# Altium schematic sheet RF_SCH.SchDoc
size A4
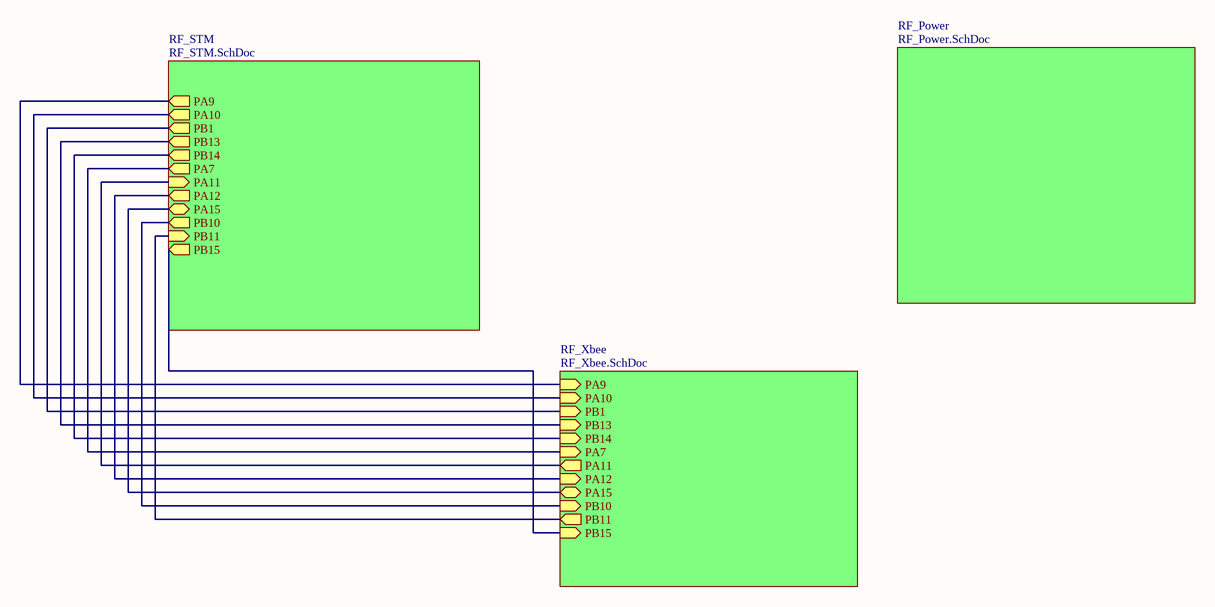
[diagram p0: RF_SCH.SchDoc]

## Sub-sheets
RF_Power = RF_Power.SchDoc: no entries
RF_STM = RF_STM.SchDoc: PA9 (out), PA10 (out), PB1 (out), PB13 (out), PB14 (out), PA7 (out), PA11 (in), PA12 (out), PA15 (bidir), PB10 (out), PB11 (in), PB15 (out)
RF_Xbee = RF_Xbee.SchDoc: PA9 (in), PA10 (in), PB1 (in), PB13 (in), PB14 (in), PA7 (in), PA11 (out), PA12 (in), PA15 (bidir), PB10 (in), PB11 (out), PB15 (in)

## Nets
(unnamed): sheet RF_STM/PA9, sheet RF_Xbee/PA9
(unnamed): sheet RF_STM/PA10, sheet RF_Xbee/PA10
(unnamed): sheet RF_STM/PB1, sheet RF_Xbee/PB1
(unnamed): sheet RF_STM/PB13, sheet RF_Xbee/PB13
(unnamed): sheet RF_STM/PB14, sheet RF_Xbee/PB14
(unnamed): sheet RF_STM/PA7, sheet RF_Xbee/PA7
(unnamed): sheet RF_STM/PA11, sheet RF_Xbee/PA11
(unnamed): sheet RF_STM/PA12, sheet RF_Xbee/PA12
(unnamed): sheet RF_STM/PA15, sheet RF_Xbee/PA15
(unnamed): sheet RF_STM/PB10, sheet RF_Xbee/PB10
(unnamed): sheet RF_STM/PB11, sheet RF_Xbee/PB11
(unnamed): sheet RF_STM/PB15, sheet RF_Xbee/PB15